# EAGLE design diplexer-GPS-RF360-B8666 (EAGLE 9.2.2)
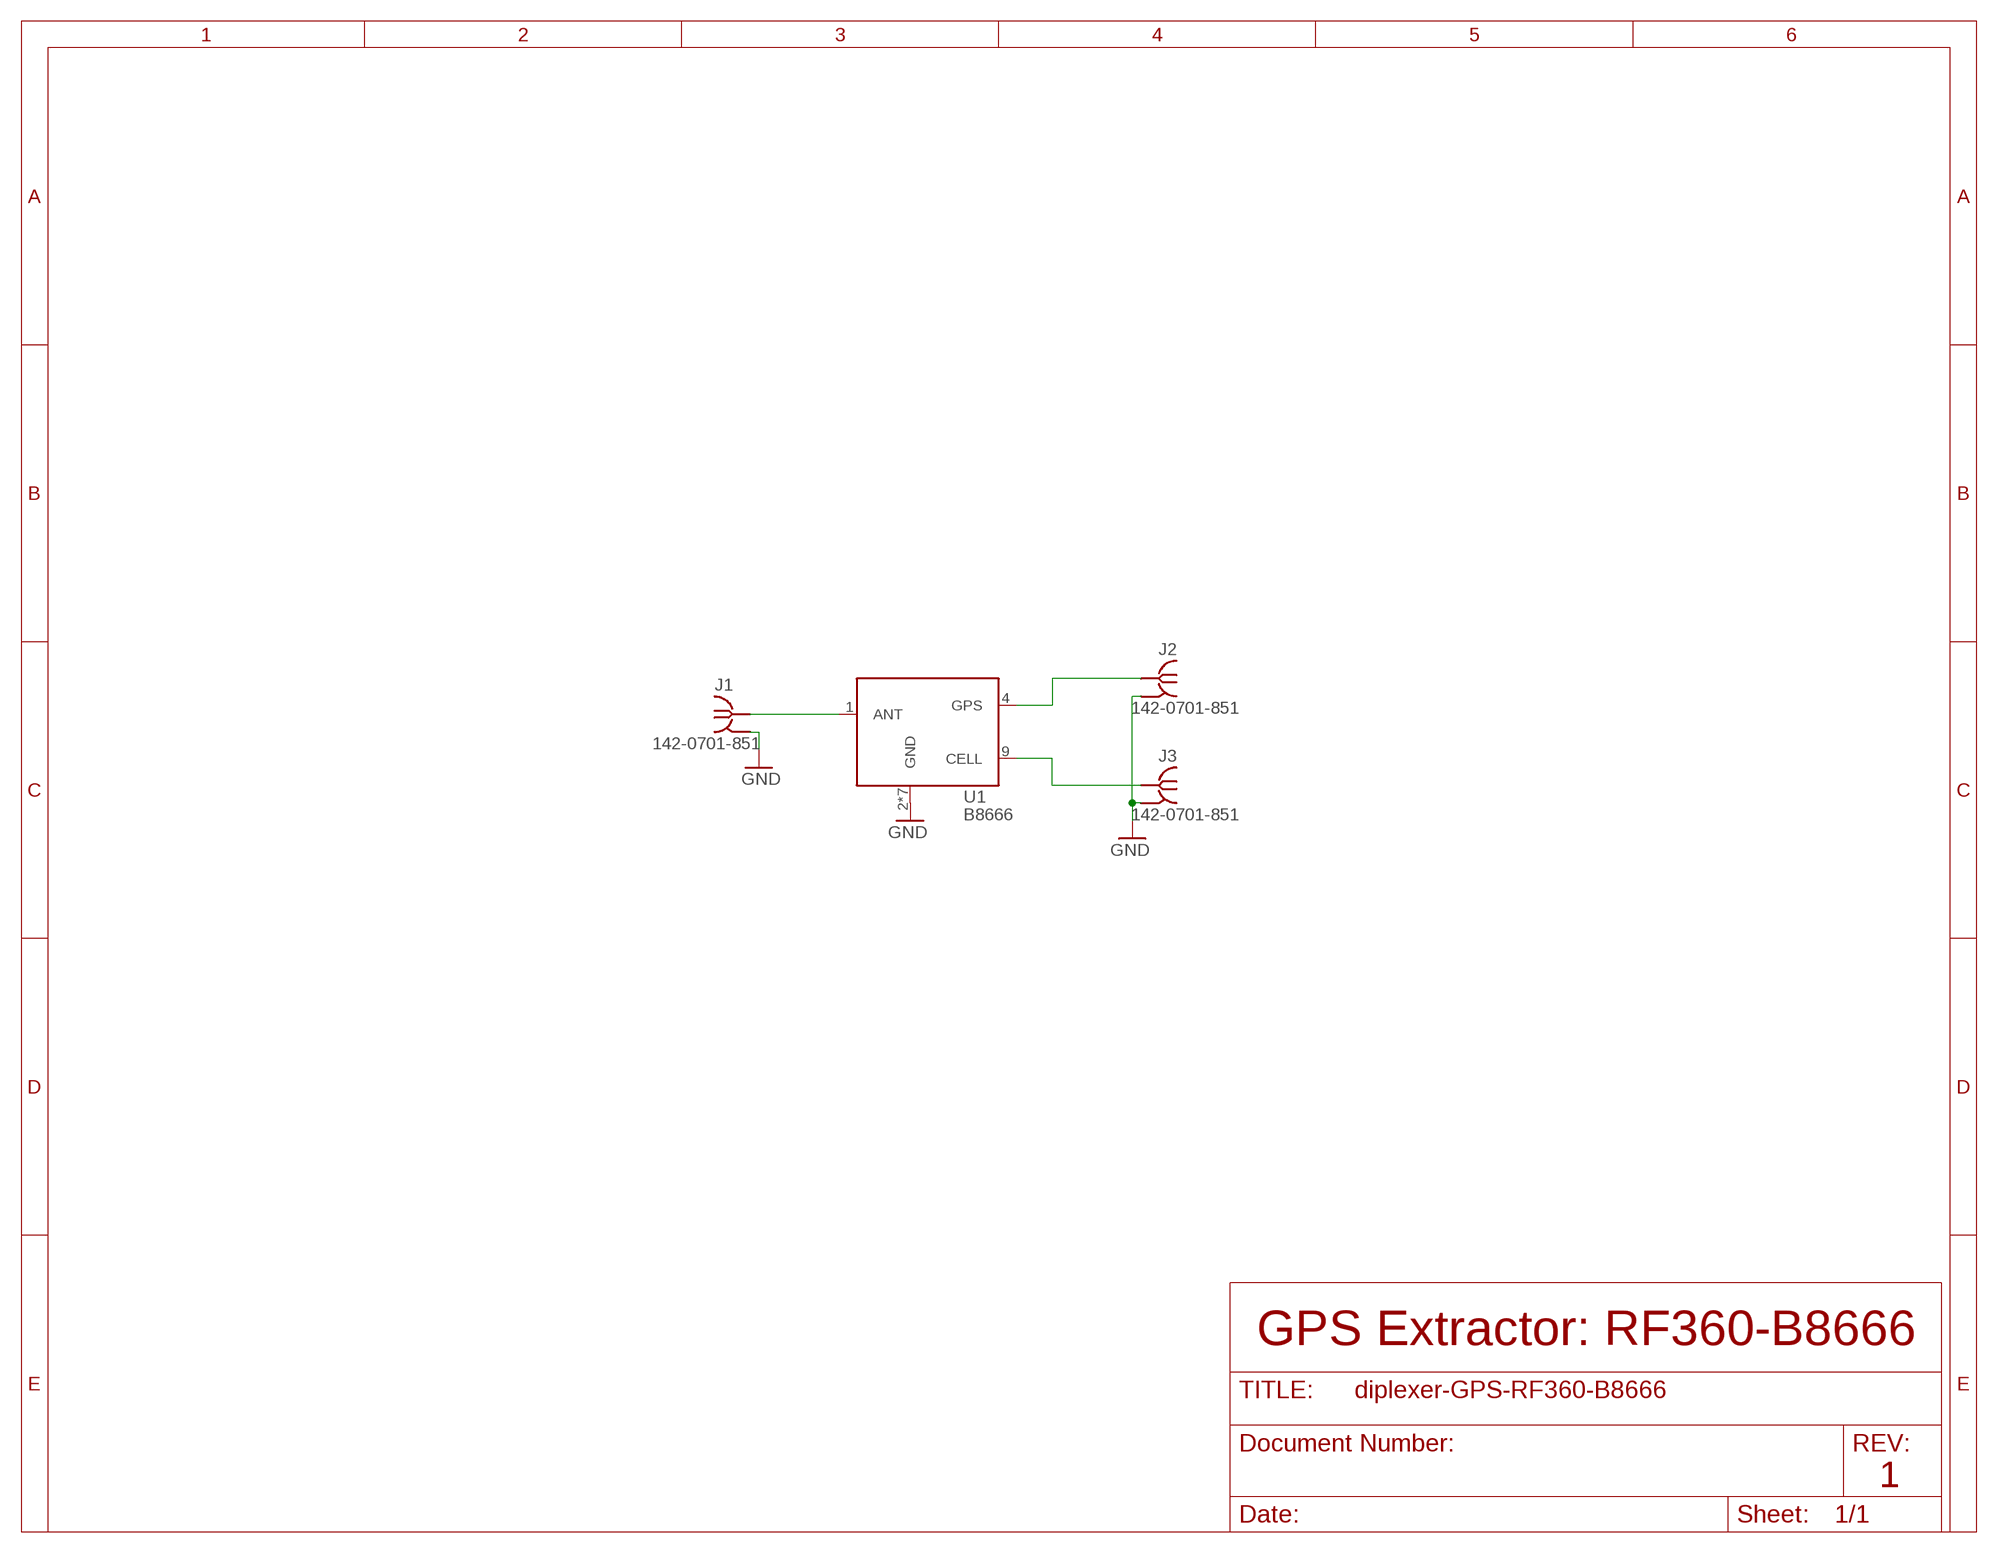
[diagram p0: schematic, sheet 1]

## Parts
J1  142-0701-851  [142-0701-851]
J2  142-0701-851  [142-0701-851]
J3  142-0701-851  [142-0701-851]
U1  B8666  [1.7X1.3]

## Nets
GND: J1.GND1(GND) J1.GND2(GND) J1.GND3(GND) J1.GND4(GND) J2.GND1(GND) J2.GND2(GND) J2.GND3(GND) J2.GND4(GND) J3.GND1(GND) J3.GND2(GND) J3.GND3(GND) J3.GND4(GND) U1.2(GND) U1.3(GND) U1.5(GND) U1.6(GND) U1.7(GND) U1.8(GND) U1.10(GND)
GPS [RF]: J2.RF1(RF) U1.4(GPS)
RF-IN [RF]: J1.RF1(RF) U1.1(ANT)
RF-OUT [RF]: J3.RF1(RF) U1.9(CELL)

## Notes on the sheet
- GPS Extractor: RF360-B8666
- 1

## Library data of the parts
J1-J3 = J-Cinch-142-0701-851-SMA-end-launch:142-0701-851: SMA Jack 50Ω - End Launch Source: Datasheet <https://belfuse.com/resources/productinformations/cinchconnectivitysolutions/johnson/pi-ccs-john-142-0701-851.pdf>
U1 = U-RF360-B8666-GPS-diplexer:B8666: GPS SAW Extractor Source: Datasheet <https://en.rf360jv.com/inf/40/ds/is/B8666.pdf>

## Net classes
1 RF: clearance 0.7 mm

## Board
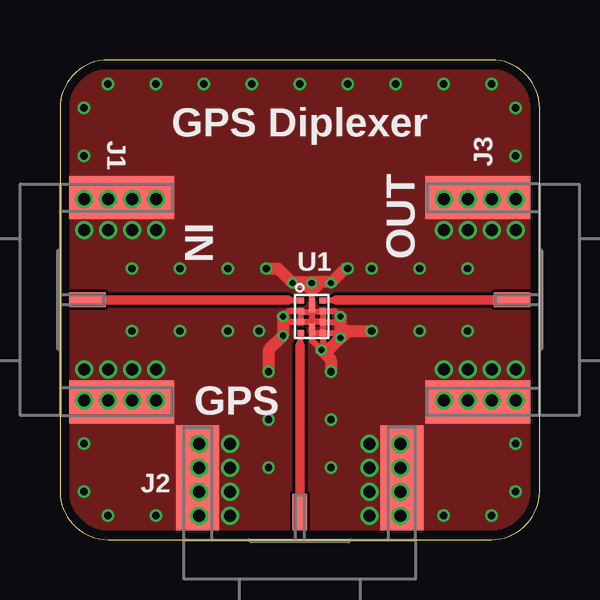
[diagram p1: board, top side]
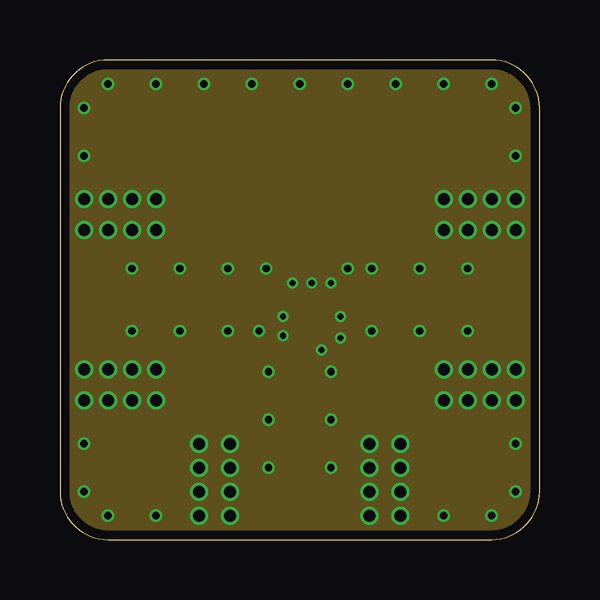
[diagram p2: board, inner layer Route2]
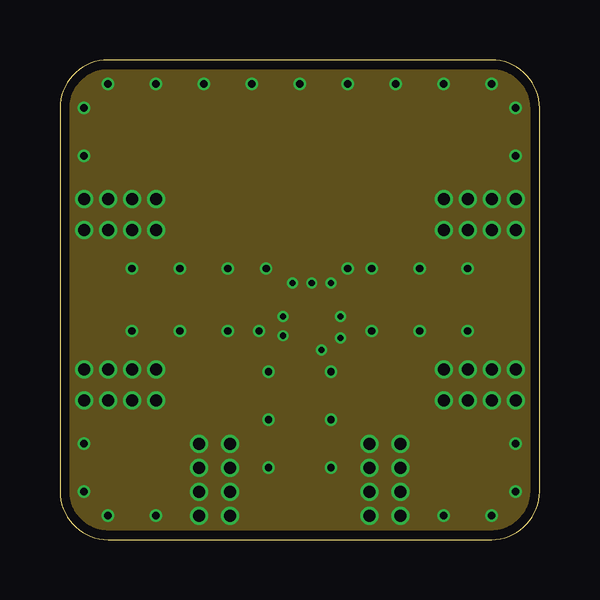
[diagram p3: board, inner layer Route15]
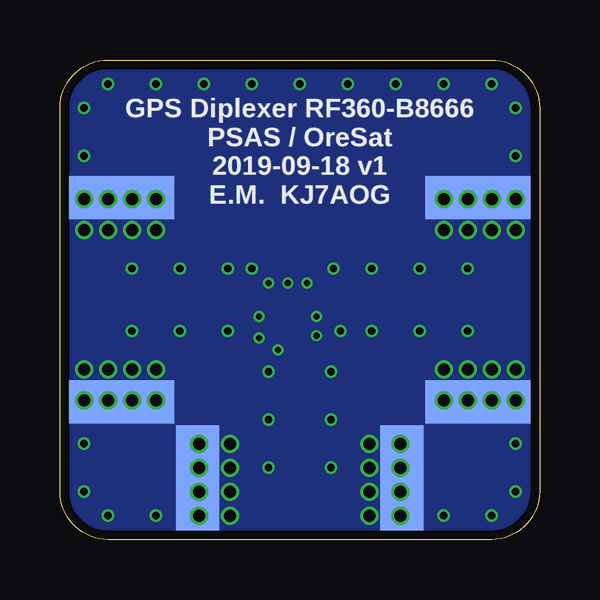
[diagram p4: board, bottom side, seen from below]

Size 20 x 20 mm. Coordinates in mm from the lower left corner, seen from the top.
Outline: 0,18 0,2 arc90 2,0 18,0 arc90 20,2 20,18 arc90 18,20 2,20 arc90 0,18
Copper layers (1*2*15*16): Top 0.035559375mm / dielectric 0.17018125mm / Route2 0.01778125mm / dielectric 47mil / Route15 0.01778125mm / dielectric 0.17018125mm / Bottom 0.035559375mm
Design rules "oshpark-4layer-tented": minimum track width 5mil, minimum drill 10mil, track to track 5mil, track to pad 5mil, pad to pad 5mil, via to via 5mil, smd to smd 5mil, copper to edge 15mil, drill to drill 6mil, minimum pad ring 4mil, minimum via ring 4mil, stop-mask expansion 2.5mil, vias tented up to drill 20mil, thermal gap 10mil

### Footprints (pad centres in the part's own frame; a part is rotated, then mirrored left to right if it is on the bottom)
142-0701-851 = smd 1.8 x 4.37: GND1 -4.255,-2.566; GND2 4.255,-2.566 | smd 1.8 x 4.37 bottom: GND3 -4.255,-2.566; GND4 4.255,-2.566 | smd 0.6 x 1.53: RF1 0,-1.146
1.7X1.3 = smd 0.25 x 0.275: 1 -0.675,-0.463; 2 -0.225,-0.463; 3 0.225,-0.463; 4 0.675,-0.463; 6 0.675,0.463; 7 0.225,0.463; 8 -0.225,0.463; 9 -0.675,0.463 | smd 0.5 x 0.25: 5 0.55,0 | smd 0.6 x 0.25: 10 -0.5,0

### Placement (x,y rotation side)
J1  0,10 90 top
J2  10,0 180 top
J3  20,10 270 top
U1  10.5,9.3 270 top

### Tracks (layer width: path | path; a pad name or v marks a point on that pad's centre or on a via)
GND  (via drill 0.25, 0.3, 0.5)
  Top 0.25: U1.2 9.53,9.53 v9.3,9.3 9.53,9.07 U1.3 | U1.8 11.47,9.53 v11.7,9.3 11.47,9.07 U1.7 | U1.6 11.47,8.62 v11.7,8.4 | 10.5,9.5 U1.10 10.5,10.2 | 10.5,9.5 10.5,9.1 | 10.5,9.1 U1.5 | 10.5,10.2 10.5,10.4 v10.5,10.7 | U1.5 10.5,8.6 10.94,8.6 U1.6 | U1.8 10.94,9.5 10.5,9.5 | U1.2 10.06,9.5 10.5,9.5 | U1.3 10.06,9.1 10.5,9.1 | U1.7 10.94,9.1 10.5,9.1 | U1.6 10.96,7.96 v10.9,7.9 10.5,8.3 U1.5 | U1.8 U1.7 | U1.7 U1.6 | 10.5,10.2 10,10.7 v9.7,10.7 | 10.5,10.2 11,10.7 v11.3,10.7 | U1.2 U1.3
  Top 0.5: v8.6,11.3 9.1,11.3 9.65,10.74 10.46,10.74 | 10.46,10.74 v10.5,10.7 | v12,11.3 11.9,11.3 11.35,10.74 10.46,10.74 | v11.7,8.4 11.2,7.9 v10.9,7.9 11.3,7.5 v11.3,7 | v11.7,9.3 v11.7,8.4 | v9.3,9.3 v9.3,8.5 8.7,7.9 v8.7,7 | v11.7,8.4 12,8.7 v13,8.7
  other vias: 1,5.8 2,5.8 3,5.8 4,5.8 1,7.1 2,7.1 3,7.1 4,7.1 1,14.2 2,14.2 3,14.2 4,14.2 1,12.9 2,12.9 3,12.9 4,12.9 5.8,4 5.8,3 5.8,2 5.8,1 7.1,1 7.1,2 7.1,3 7.1,4 14.2,4 14.2,3 14.2,2 14.2,1 12.9,1 12.9,2 12.9,3 12.9,4 16,5.8 17,5.8 18,5.8 19,5.8 16,7.1 17,7.1 18,7.1 19,7.1 16,14.2 17,14.2 18,14.2 19,14.2 16,12.9 17,12.9 18,12.9 19,12.9 1,2 2,1 4,1 1,4 18,1 19,2 16,1 19,4 19,18 19,16 18,19 1,18 1,16 2,19 4,19 6,19 8,19 10,19 12,19 14,19 16,19 3,8.7 5,8.7 7,8.7 8.3,8.7 3,11.3 5,11.3 7,11.3 17,11.3 15,11.3 13,11.3 17,8.7 15,8.7 8.7,3 11.3,3 11.3,5 8.7,5
  pour Top: 0,20 20,20 20,0 0,0
  pour Bottom: 0,20 20,20 20,0 0,0
  pour Route2: 0,20 20,20 20,0 0,0
  pour Route15: 0,20 20,20 20,0 0,0
  pour Top (no thermals): 0,16 6,16 6,6 14,6 14,16 20,16 20,0 0,0
  pour Bottom (no thermals): 0,16 6,16 6,6 14,6 14,16 20,16 20,0 0,0
GPS
  Top 0.25: 10,8.1 10.04,8.14 U1.4
  Top 0.39: J2.RF1 10,8.1
RF-IN
  Top 0.25: U1.1 9.5,9.97 9.5,10
  Top 0.39: 9.5,10 J1.RF1
RF-OUT
  Top 0.25: 11.5,10 11.5,9.97 U1.9
  Top 0.39: J3.RF1 11.5,10

### Text on the board
tPlace: GPS Diplexer | IN | OUT | GPS
bPlace: GPS Diplexer RF360-B8666 / PSAS / OreSat / 2019-09-18 v1 / E.M. KJ7AOG